# EAGLE design OSSM_Main_PCB (EAGLE 9.6.2)
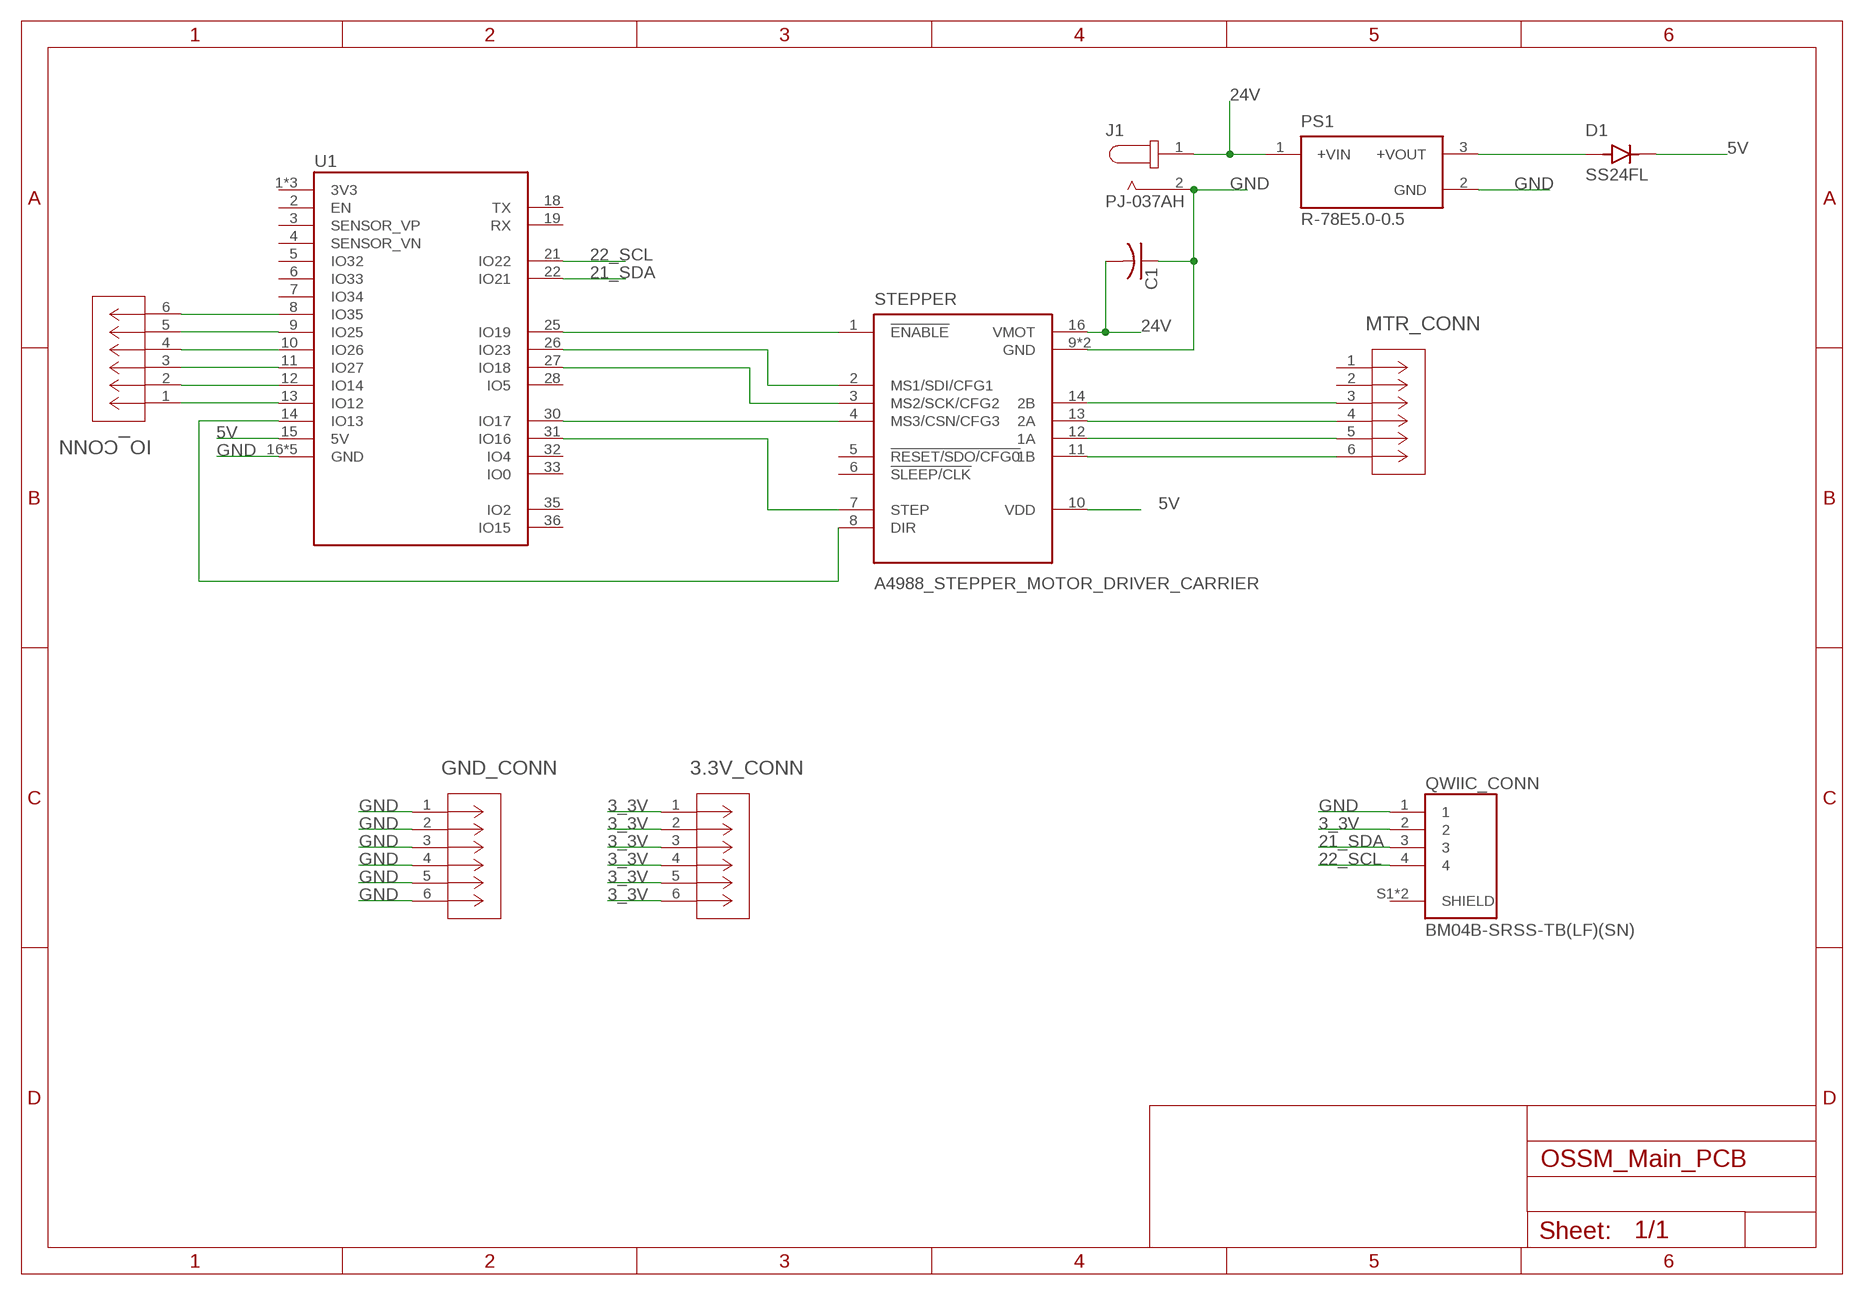
[diagram p0: schematic, sheet 1]

## Parts
3.3V_CONN  1792902  [CONN_1792902_PXC]
C1  C-US050-024X044  [C050-024X044]
D1  SS24FL  [SODFL3617X108N]
GND_CONN  1792902  [CONN_1792902_PXC]
IO_CONN  1792902  [CONN_1792902_PXC]
J1  PJ-037AH  [CUI_PJ-037AH]
MTR_CONN  1792902  [CONN_1792902_PXC]
PS1  R-78E5.0-0.5  [CONV_R-78E5.0-0.5]
QWIIC_CONN  BM04B-SRSS-TB(LF)(SN)  [CONN_BM04B-SRSS-TB(LF)(SN)]
STEPPER  A4988_STEPPER_MOTOR_DRIVER_CARRIER  [MODULE_A4988_STEPPER_MOTOR_DRIVER_CARRIER]
U1  LOLIN32_PRODUCTION  [LOLIN32_PRODUCTION]

## Nets
3_3V: 3.3V_CONN.1 3.3V_CONN.2 3.3V_CONN.3 3.3V_CONN.4 3.3V_CONN.5 3.3V_CONN.6 QWIIC_CONN.2
5V: D1.C STEPPER.10(VDD) U1.15(5V)
21_SDA: QWIIC_CONN.3 U1.22(IO21)
22_SCL: QWIIC_CONN.4 U1.21(IO22)
24V: C1.2 J1.1 PS1.1(+VIN) STEPPER.16(VMOT)
GND: C1.1 GND_CONN.1 GND_CONN.2 GND_CONN.3 GND_CONN.4 GND_CONN.5 GND_CONN.6 J1.2 PS1.2(GND) QWIIC_CONN.1 STEPPER.9(GND) STEPPER.15(GND) U1.16(GND) U1.17(GND) U1.23(GND) U1.24(GND) U1.34(GND)
N$1: D1.A PS1.3(+VOUT)
N$2: STEPPER.1(!ENABLE) U1.25(IO19)
N$3: STEPPER.2(MS1/SDI/CFG1) U1.26(IO23)
N$4: STEPPER.3(MS2/SCK/CFG2) U1.27(IO18)
N$5: STEPPER.4(MS3/CSN/CFG3) U1.30(IO17)
N$6: STEPPER.7(STEP) U1.31(IO16)
N$7: STEPPER.8(DIR) U1.14(IO13)
N$8: MTR_CONN.6 STEPPER.11(1B)
N$9: MTR_CONN.5 STEPPER.12(1A)
N$10: MTR_CONN.4 STEPPER.13(2A)
N$11: MTR_CONN.3 STEPPER.14(2B)
N$12: IO_CONN.1 U1.13(IO12)
N$13: IO_CONN.2 U1.12(IO14)
N$14: IO_CONN.3 U1.11(IO27)
N$15: IO_CONN.4 U1.10(IO26)
N$16: IO_CONN.5 U1.9(IO25)
N$17: IO_CONN.6 U1.8(IO35)
Unconnected: MTR_CONN.1 MTR_CONN.2 QWIIC_CONN.S1(SHIELD) QWIIC_CONN.S2(SHIELD) STEPPER.5(!RESET/SDO/CFG0) STEPPER.6(!SLEEP/CLK) U1.2(EN) U1.3(SENSOR_VP) U1.4(SENSOR_VN) U1.5(IO32) U1.6(IO33) U1.7(IO34) U1.18(TX) U1.19(RX) U1.28(IO5) U1.32(IO4) U1.33(IO0) U1.35(IO2) U1.36(IO15)

## Power pins joined to a net without a drawn wire
3V3: U1.1(3V3) U1.20(3V3) U1.29(3V3)

## Library data of the parts
3.3V_CONN GND_CONN IO_CONN MTR_CONN = @DT-TRAINER:1792902; ARTICLE_DESCRIPTION: PTS 1,5/ 6-5,0-H; BUILT_BY: EMA_Cory; CONTACT_TYPE: Unknown; COPYRIGHT: Copyright (C) 2018 Accelerated Designs. All rights reserved; MANUFACTURER_PART_NUMBER: 1792902; NUMBER_OF_CONNECTION: 6; NUMBER_OF_POSITION_PER_ROW: 6; NUMBER_OF_POTENTIALS: 6; NUMBER_OF_ROWS: 1; NUMBER_OF_SOLDER_PINS_PER_POTENTIALS: 1; PITCH__MM_: 5; PLUG_SYSTEM: Unknown; PRODUCTTYP: Printed circuit board terminal; PRODUCT_FAMILY: PTS 1,5/..-H; SOLDER_PIN_LENGTH__MM_: 2.5; SOURCELIBRARY: Phoenix_Contact_2020-03-19; VENDOR: Phoenix Contact
C1 = rcl:C-US: CAPACITOR, American symbol; SPICEPREFIX: C
D1 = SS24FL:SS24FL: Diode Schottky Barrier Rectifier 30V 1A 2-Pin SOD-123F T/R; DESCRIPTION: Diode Schottky 40V 2A Surface Mount SOD-123F; DIGI-KEY_PART_NUMBER: SS24FLCT-ND; MF: ON Semiconductor; MP: SS24FL; PACKAGE: SOD-123 FL-2 ON Semiconductor; PURCHASE-URL: https://pricing.snapeda.com/search/part/SS24FL/?ref=eda
J1 = PJ-037AH:PJ-037AH: 2.0 x 6.5 mm, 5.0 A, Horizontal, Through Hole, Dc Power Jack Connector; MANUFACTURER: CUI Devices; MAXIMUM_PACKAGE_HEIGHT: 11.2 mm; PARTREV: 1.05; STANDARD: Manufacturer Recommendations
PS1 = R-78E5.0-0.5:R-78E5.0-0.5: 0.5 Amp SIP3 Single Output; DESCRIPTION: Switching regulator module - DC/DC converter . Single Output. 7.0V to 28.0V input voltage range and 5 V output voltage range; DIGI-KEY_PART_NUMBER: 945-1648-5-ND; MF: Recom Power; MP: R-78E5.0-0.5; PACKAGE: SIP-3 Recom Power; PURCHASE-URL: https://pricing.snapeda.com/search/part/R-78E5.0-0.5/?ref=eda
QWIIC_CONN = BM04B-SRSS-TB_LF__SN_:BM04B-SRSS-TB(LF)(SN): BM04B Series 1 mm Pitch 4 Position SMT Single Row Top Entry Shrouded Header; DESCRIPTION: Connector Header Surface Mount 4 position 0.039 (1.00mm); DIGI-KEY_PART_NUMBER: 455-1790-1-ND; MF: JST Sales; MP: BM04B-SRSS-TB(LF)(SN); PACKAGE: None; PURCHASE-URL: https://pricing.snapeda.com/search/part/BM04B-SRSS-TB(LF)(SN)/?ref=eda
STEPPER = A4988_STEPPER_MOTOR_DRIVER_CARRIER:A4988_STEPPER_MOTOR_DRIVER_CARRIER: Stepper motor controler; IC: A4988; 1A; Uin mot: 8÷35V; AVAILABILITY: Unavailable; DESCRIPTION: Stepper Motor Driver; MF: Pololu; MP: A4988 STEPPER MOTOR DRIVER CARRIER; PACKAGE: None; PRICE: None
U1 = $DT-TRAINER:LOLIN32_PRODUCTION: Eval Board For Esp-Wroom-32

## Board
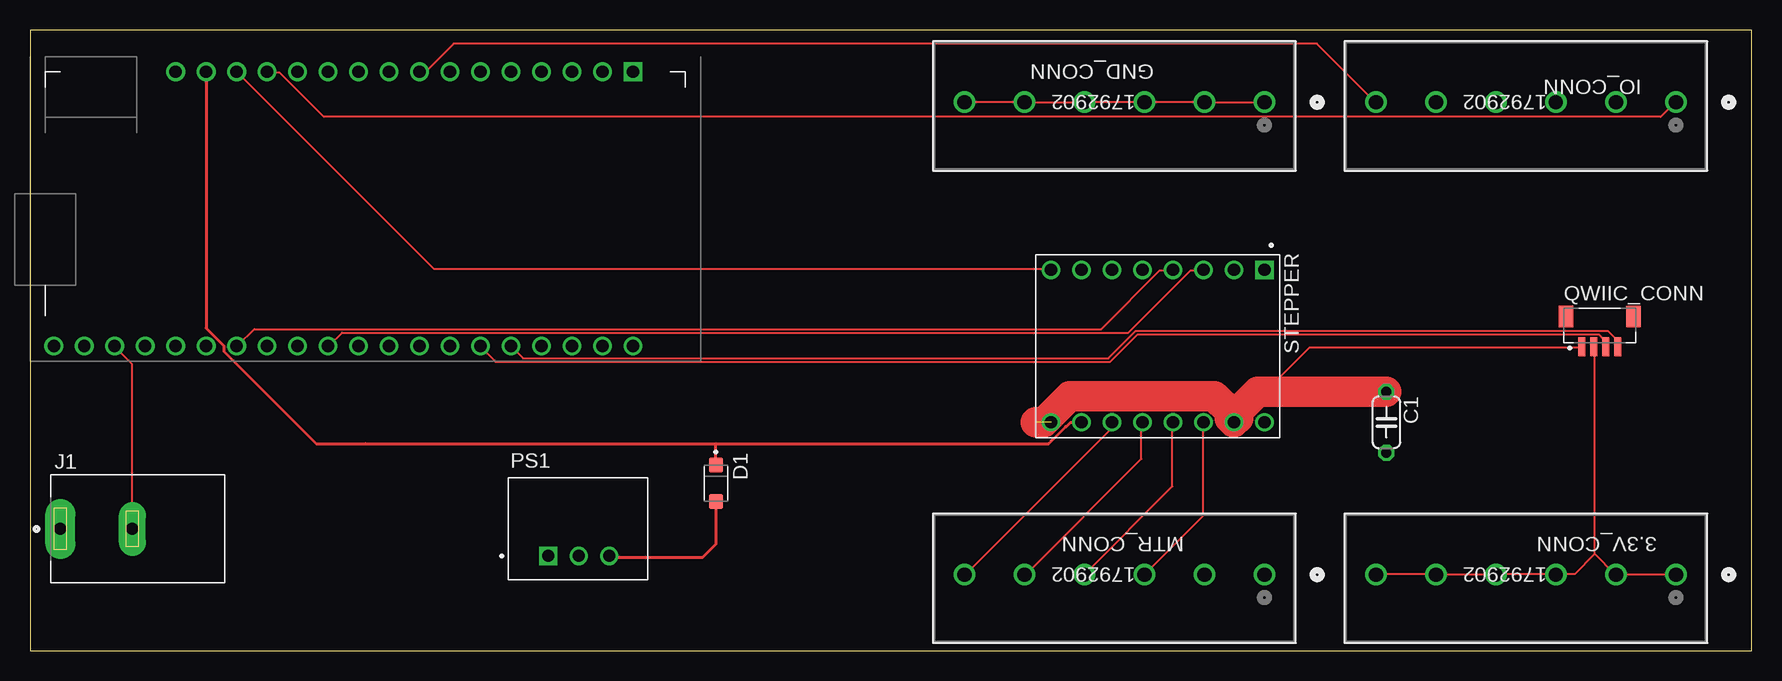
[diagram p1: board, top side]
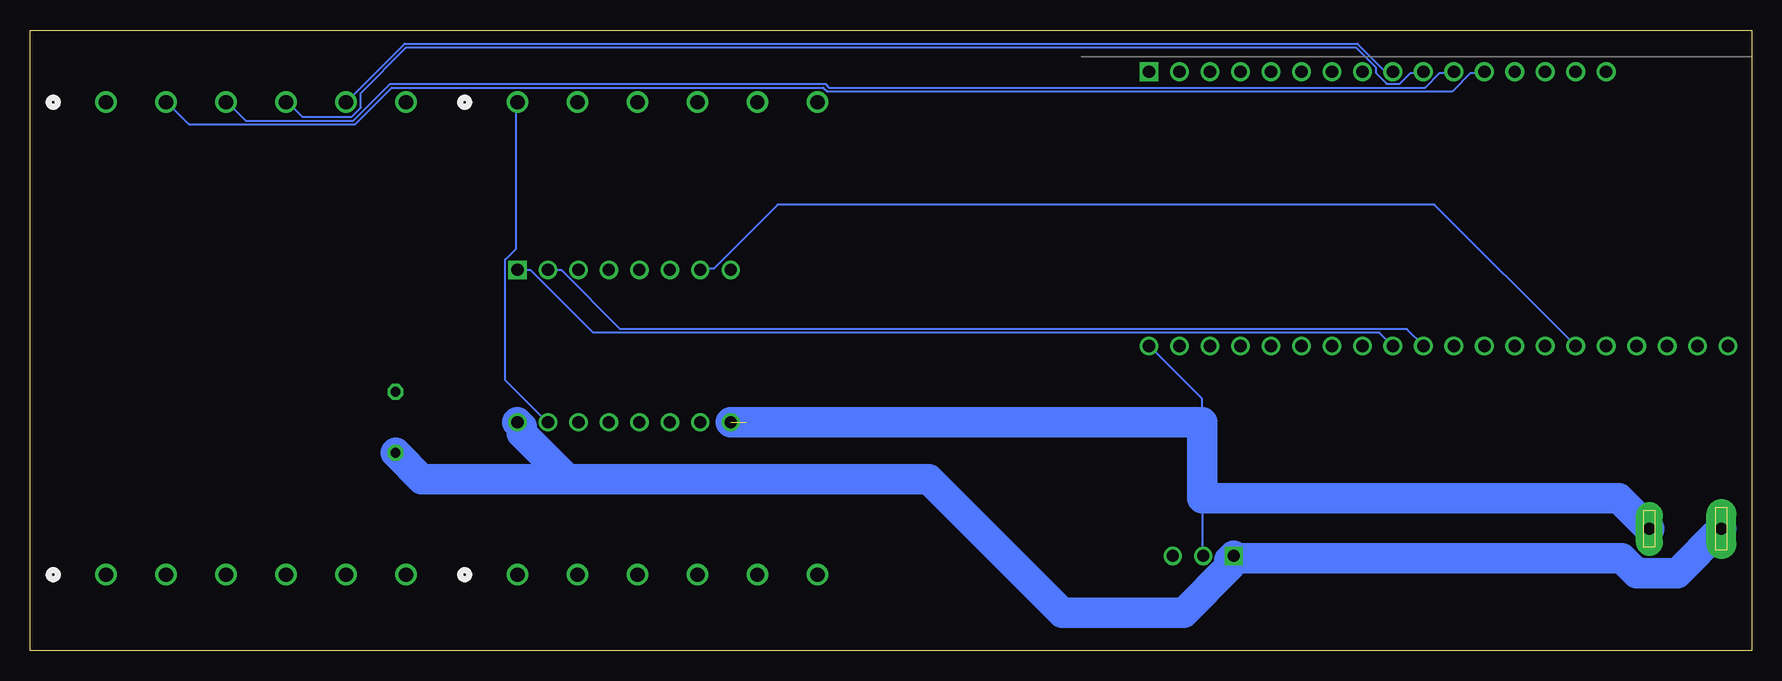
[diagram p2: board, bottom side, seen from below]

Size 143.49 x 51.74 mm. Coordinates in mm from the lower left corner, seen from the top.
Outline: 0,0 143.49,0 143.49,51.74 0,51.74 0,0
Copper layers (1*16): Top 0.035mm / dielectric 1.5mm / Bottom 0.035mm
Design rules "default": minimum track width 6mil, minimum drill 0.35mm, track to track 6mil, track to pad 6mil, pad to pad 6mil, via to via 6mil, smd to smd 6mil, copper to edge 40mil, drill to drill 6mil, minimum pad ring 10mil, minimum via ring 8mil, stop-mask expansion 4mil, vias tented up to drill 0mil, thermal gap 10mil

### Footprints (pad centres in the part's own frame; a part is rotated, then mirrored left to right if it is on the bottom)
CONN_1792902_PXC = drill 1.194 pad 1.702: 1 0,0; 2 5.004,0; 3 10.008,0; 4 15.011,0; 5 19.99,0; 6 24.994,0
C050-024X044 = drill 0.813 octagon: 1 -2.54,0; 2 2.54,0
SODFL3617X108N = smd 1.25 x 1.16: A 1.53,0; C -1.53,0
CUI_PJ-037AH = drill 1 pad 2.5 long: 1 0,0 | drill 1 pad 2.25 long: 2 6,0
CONV_R-78E5.0-0.5 = drill 1 square: 1 -2.54,-2.25 | drill 1: 2 0,-2.25; 3 2.54,-2.25
CONN_BM04B-SRSS-TB(LF)(SN) = smd 0.6 x 1.55: 1 -1.5,-1.325; 2 -0.5,-1.325; 3 0.5,-1.325; 4 1.5,-1.325 | smd 1.2 x 1.8: S1 -2.8,1.2; S2 2.8,1.2
MODULE_A4988_STEPPER_MOTOR_DRIVER_CARRIER = drill 1.02 square: 1 -6.35,8.89 | drill 1.02: 2 -6.35,6.35; 3 -6.35,3.81; 4 -6.35,1.27; 5 -6.35,-1.27; 6 -6.35,-3.81; 7 -6.35,-6.35; 8 -6.35,-8.89; 9 6.35,-8.89; 10 6.35,-6.35; 11 6.35,-3.81; 12 6.35,-1.27; 13 6.35,1.27; 14 6.35,3.81; 15 6.35,6.35; 16 6.35,8.89
LOLIN32_PRODUCTION = drill 1.04 square: 1 1.27,48.97 | drill 1.04: 2 1.27,46.43; 3 1.27,43.89; 4 1.27,41.35; 5 1.27,38.81; 6 1.27,36.27; 7 1.27,33.73; 8 1.27,31.19; 9 1.27,28.65; 10 1.27,26.11; 11 1.27,23.57; 12 1.27,21.03; 13 1.27,18.49; 14 1.27,15.95; 15 1.27,13.41; 16 1.27,10.87; 17 24.13,48.97; 18 24.13,46.43; 19 24.13,43.89; 20 24.13,41.35; 21 24.13,38.81; 22 24.13,36.27; 23 24.13,33.73; 24 24.13,31.19; 25 24.13,28.65; 26 24.13,26.11; 27 24.13,23.57; 28 24.13,21.03; 29 24.13,18.49; 30 24.13,15.95; 31 24.13,13.41; 32 24.13,10.87; 33 24.13,8.33; 34 24.13,5.79; 35 24.13,3.25; 36 24.13,0.71

### Placement (x,y rotation side)
3.3V_CONN  137.16,6.35 180 top
C1  113.03,19.05 270 top
D1  57.15,13.97 270 top
GND_CONN  102.87,45.72 180 top
IO_CONN  137.16,45.72 180 top
J1  2.54,10.16 0 top
MTR_CONN  102.87,6.35 180 top
PS1  45.72,10.16 0 top
QWIIC_CONN  130.81,26.67 0 top
STEPPER  93.98,25.4 270 top
U1  1.27,49.53 270 top

### Tracks (layer width: path | path; a pad name or v marks a point on that pad's centre or on a via)
3_3V
  Top 0.152: 3.3V_CONN.6 112.27,6.4 117.15,6.4 3.3V_CONN.5 117.3,6.4 122.02,6.4 3.3V_CONN.4 122.17,6.4 127.05,6.4 3.3V_CONN.3 127.2,6.4 128.73,6.4 130.4,8.08 | 130.4,8.08 130.4,25.3 QWIIC_CONN.2 | 130.4,8.08 132.08,6.4 3.3V_CONN.2 132.23,6.4 137.11,6.4 3.3V_CONN.1
5V
  Top 0.152: 86.67,19.05 87.58,19.05 STEPPER.10 | 27.63,17.27 27.94,17.27 57.15,17.27 84.89,17.27
  Top 0.254: D1.C 57.15,17.27 | U1.15 14.68,26.9 16.16,25.42 16.16,24.96 23.85,17.27 27.94,17.27 84.89,17.27 | 84.89,17.27 85.24,17.63 | 84.89,17.27 86.31,18.69 86.36,18.69 86.71,19.05 STEPPER.10
21_SDA
  Top 0.152: QWIIC_CONN.3 131.17,25.45 131.17,25.91 130.71,26.36 92.3,26.36 90.02,24.08 38.81,24.08 37.59,25.3 U1.22
22_SCL
  Top 0.152: QWIIC_CONN.4 132.23,25.45 132.23,25.91 131.47,26.67 92.15,26.67 89.87,24.38 41.1,24.38 40.18,25.3 U1.21
24V
  Bottom 0.152: J1.1 2.54,10.06 4.98,7.62 9.09,7.62 9.25,7.77 43.08,7.77 PS1.1 43.23,7.77 43.28,7.72 44.14,6.86 | 101.75,19.05 102.82,19.05 STEPPER.16
  Bottom 2.54: 43.28,7.72 10.83,7.72 9.59,6.49 6.21,6.49 J1.1 | 98.7,14.32 102.52,18.14 102.52,18.7 STEPPER.16 | PS1.1 43.54,7.55 43.54,7.01 47.36,3.19 57.47,3.19 68.6,14.32 98.7,14.32 | 98.7,14.32 110.84,14.32 C1.2
GND  (1 unrouted)
  Top 0.152: GND_CONN.6 77.98,45.72 82.86,45.72 GND_CONN.5 83.01,45.72 87.73,45.72 GND_CONN.4 87.88,45.72 92.76,45.72 GND_CONN.3 92.91,45.72 97.79,45.72 GND_CONN.2 97.94,45.72 102.82,45.72 GND_CONN.1 | QWIIC_CONN.1 129.18,25.3 106.63,25.3 100.38,19.05 STEPPER.15 | J1.2 8.48,10.21 8.48,23.93 7.11,25.3 U1.34
  Top 2.54: 83.82,19.05 84.47,19.05 86.66,21.24 98.7,21.24 99.98,19.96 99.98,19.4 STEPPER.15 100.68,19.4 100.68,19.96 102.32,21.59 C1.1
  Bottom 0.152: GND_CONN.1 102.97,45.72 102.97,33.53 103.89,32.61 103.89,22.55 100.38,19.05 STEPPER.15 | 45.82,19.05 45.82,21.03 50.09,25.3 U1.17 50.24,25.3 | 45.82,12.7 45.82,8.89 45.82,7.92 PS1.2 | 56.49,19.05 84.99,19.05 STEPPER.9
  Bottom 2.54: J1.2 11.08,12.7 45.82,12.7 45.82,19.05 STEPPER.9
N$1
  Top 0.152: 48.26,7.77 PS1.3
  Top 0.254: D1.A 57.15,8.89 56.03,7.77 48.26,7.77
N$2
  Bottom 0.152: STEPPER.1 102.82,31.7 101.75,31.7 96.57,26.52 31.04,26.52 29.97,25.45 U1.25
N$3
  Bottom 0.152: STEPPER.2 100.23,31.7 99.16,31.7 94.29,26.82 28.75,26.82 27.38,25.45 U1.26
N$4
  Top 0.152: STEPPER.3 97.79,31.7 96.72,31.7 91.54,26.52 26.01,26.52 24.94,25.45 U1.27
N$5
  Top 0.152: STEPPER.4 95.2,31.7 94.13,31.7 89.26,26.82 18.69,26.82 17.32,25.45 U1.30
N$6
  Bottom 0.152: STEPPER.7 87.58,31.85 86.51,31.85 81.18,37.19 26.47,37.19 14.73,25.45 U1.31
N$7
  Top 0.152: STEPPER.8 84.99,31.85 33.63,31.85 17.32,48.16 U1.14
N$8
  Top 0.152: STEPPER.11 90.17,18.59 77.98,6.4 MTR_CONN.6
N$9
  Top 0.152: STEPPER.12 92.61,19.05 92.61,16 83.01,6.4 MTR_CONN.5
N$10
  Top 0.152: STEPPER.13 95.2,19.05 95.2,13.72 87.88,6.4 MTR_CONN.4
N$11
  Top 0.152: STEPPER.14 97.79,11.28 92.91,6.4 MTR_CONN.3
N$12
  Top 0.152: U1.13 19.76,48.16 20.83,48.16 24.49,44.5 135.89,44.5 137.11,45.72 IO_CONN.1
N$13
  Bottom 0.152: U1.12 22.35,48.16 23.42,48.16 24.94,46.63 77.06,46.63 77.37,46.94 113.34,46.94 116.38,43.89 130.25,43.89 132.08,45.72 IO_CONN.2
N$14
  Bottom 0.152: U1.11 24.94,48.16 26.01,48.16 27.23,46.94 76.91,46.94 77.22,47.24 113.49,47.24 116.54,44.2 125.53,44.2 127.05,45.72 IO_CONN.3
N$15
  Bottom 0.152: U1.10 27.38,48.16 28.45,48.16 29.36,47.24 30.43,47.24 31.34,48.16 31.34,48.62 33.02,50.29 112.12,50.29 115.93,46.48 115.93,45.26 116.69,44.5 120.8,44.5 122.02,45.72 IO_CONN.4
N$16
  Bottom 0.152: U1.9 29.97,48.31 30.58,48.31 32.87,50.6 112.27,50.6 117.15,45.72 IO_CONN.5
N$17
  Top 0.152: U1.8 32.56,48.31 33.02,48.31 35.31,50.6 107.24,50.6 112.12,45.72 IO_CONN.6